# Altium project BRZ_LightLink_V2.PrjPcb
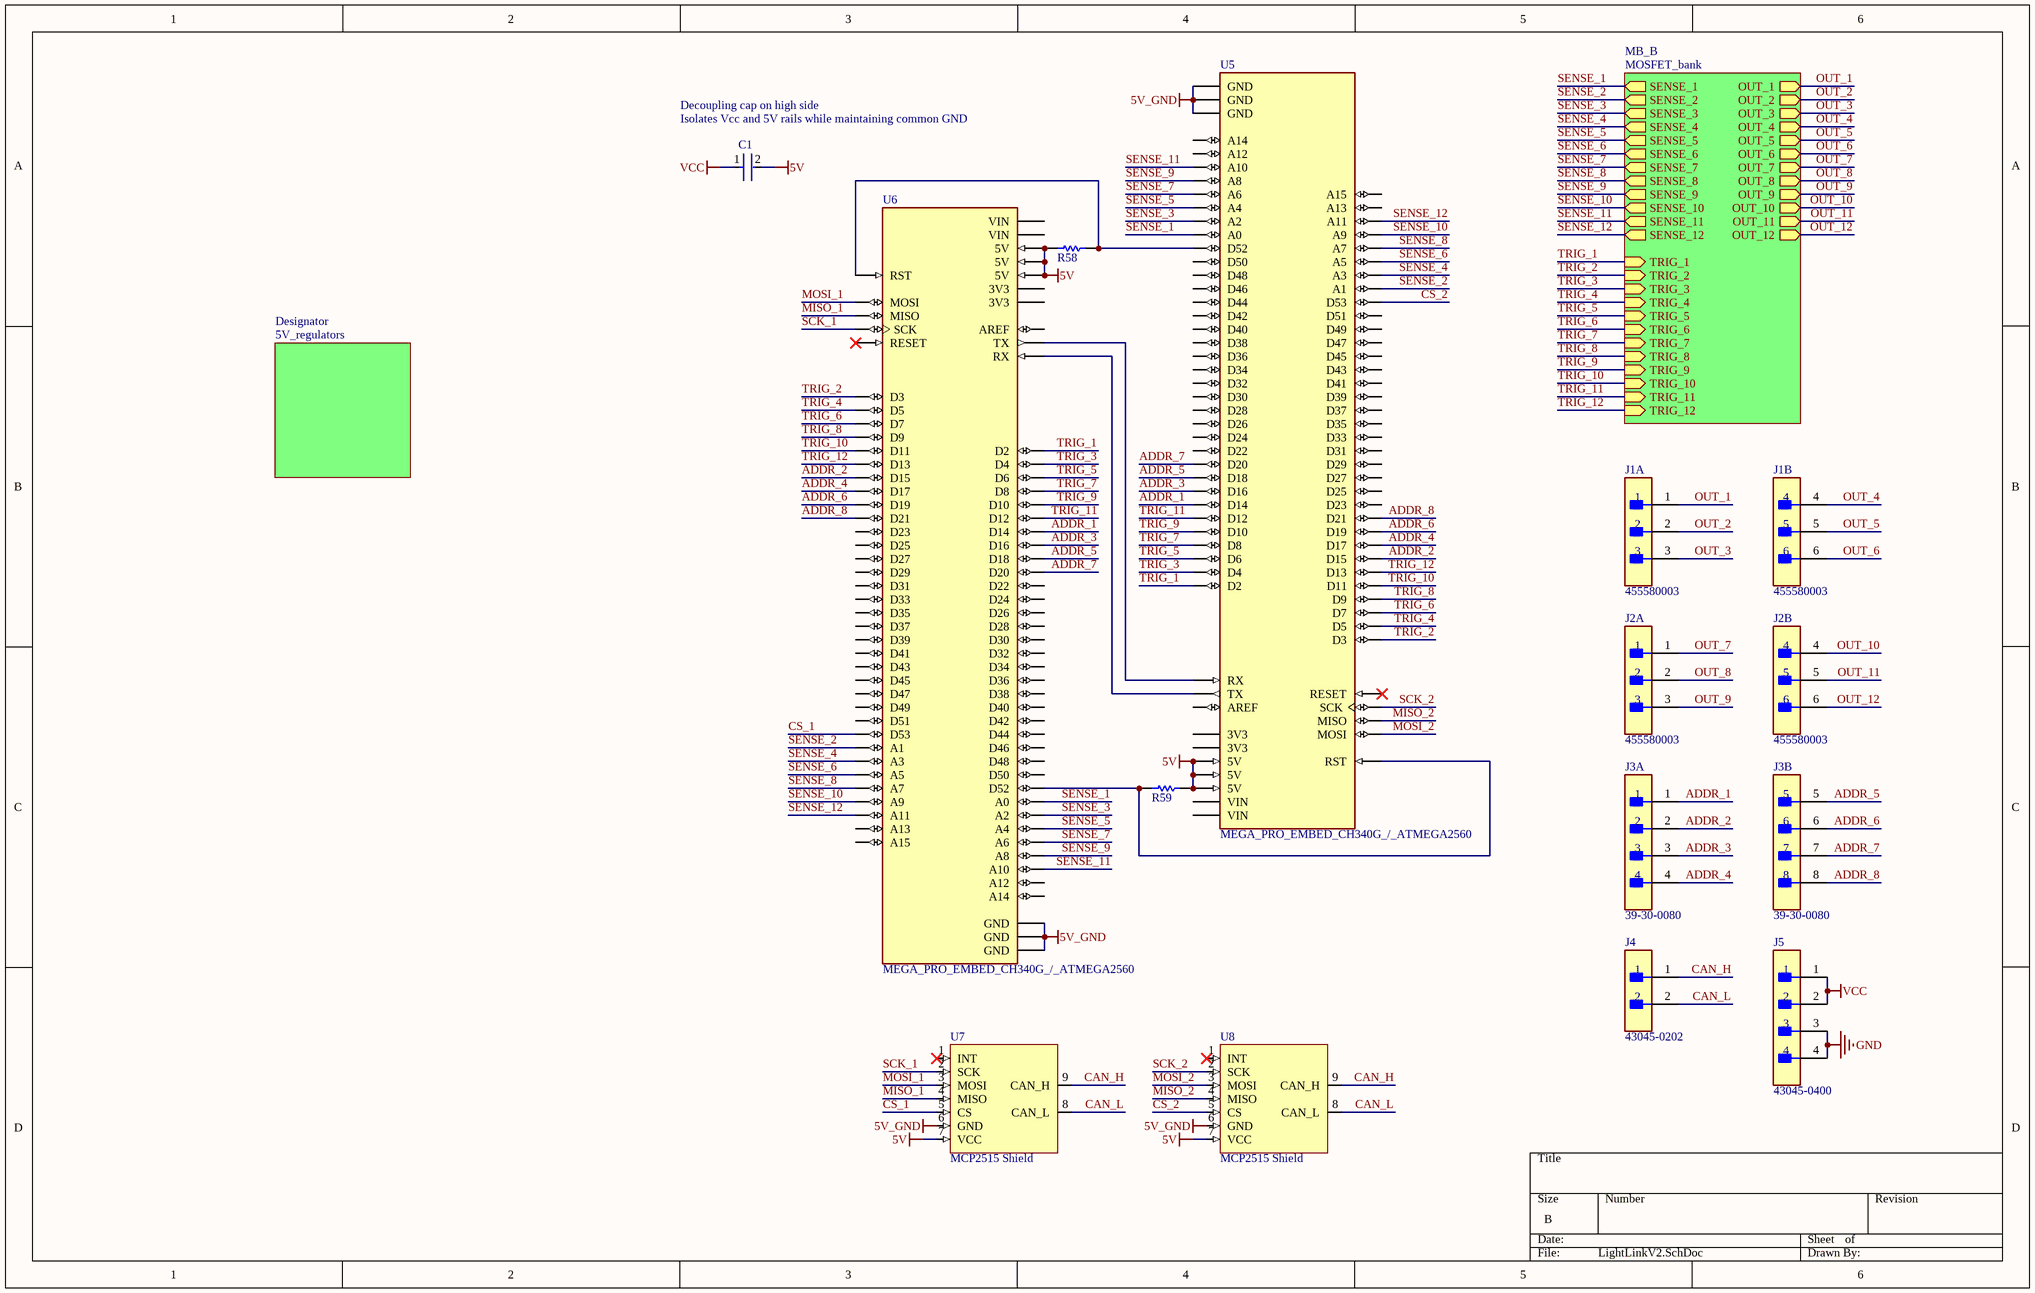
[diagram p0: LightLinkV2.SchDoc]
4 sheets, 286 parts. Net scope: hierarchical (ports join the sheet entries above them; power ports are global).
Sheets:
  LightLinkV2.SchDoc
    MB_B = MOSFET_bank.SchDoc
      M = MOSFET.SchDoc
      M = MOSFET.SchDoc
      M = MOSFET.SchDoc
      M = MOSFET.SchDoc
      M = MOSFET.SchDoc
      M = MOSFET.SchDoc
      M = MOSFET.SchDoc
      M = MOSFET.SchDoc
      M = MOSFET.SchDoc
      M = MOSFET.SchDoc
      M = MOSFET.SchDoc
      M = MOSFET.SchDoc
    Designator = 5V_regulators.SchDoc

## Sheet LightLinkV2.SchDoc
size B; SheetNumber: 1; SheetTotal: 4

### Parts
C1  C0603C103K5RACTU  [FP-C0603C-CF-MFG]  (value not drawn)
J1  455580003  [FP-455580003-MFG]  (parts A,B of 2)
J2  455580003  [FP-455580003-MFG]  (parts A,B of 2)
J3  39-30-0080  [FP-39-30-0080-MFG]  (parts A,B of 2)
J4  43045-0202  [FP-43045-0202-MFG]
J5  43045-0400  [FP-43045-0400-MFG]
R58  ERJ3EKF1002V  [RESC1609X55X30LL15T15]  (value not drawn)
R59  ERJ3EKF1002V  [RESC1609X55X30LL15T15]  (value not drawn)
U5  MEGA_PRO_EMBED_CH340G_/_ATMEGA2560  [MODULE_MEGA_PRO_EMBED_CH340G_/_ATMEGA2560]
U6  MEGA_PRO_EMBED_CH340G_/_ATMEGA2560  [MODULE_MEGA_PRO_EMBED_CH340G_/_ATMEGA2560]
U7  MCP2515 Shield  [MCP2515 Shield-Footprint-1]
U8  MCP2515 Shield  [MCP2515 Shield-Footprint-1]

### Sub-sheets
Designator = 5V_regulators: no entries
MB_B = MOSFET_bank: SENSE_1 (out), SENSE_2 (out), SENSE_3 (out), SENSE_4 (out), TRIG_1 (in), OUT_1 (out), TRIG_2 (in), OUT_2 (out), TRIG_3 (in), OUT_3 (out), TRIG_4 (in), OUT_4 (out), SENSE_5 (out), SENSE_6 (out), SENSE_7 (out), SENSE_8 (out), TRIG_5 (in), OUT_5 (out), TRIG_6 (in), OUT_6 (out), TRIG_7 (in), OUT_7 (out), TRIG_8 (in), OUT_8 (out), SENSE_9 (out), SENSE_10 (out), SENSE_11 (out), SENSE_12 (out), TRIG_9 (in), OUT_9 (out), TRIG_10 (in), OUT_10 (out), TRIG_11 (in), OUT_11 (out), TRIG_12 (in), OUT_12 (out)

### Nets
5V: C1.2 R58.2 R59.1 U5.5V_1(5V) U5.5V_2(5V) U5.5V_3(5V) U6.5V_1(5V) U6.5V_2(5V) U6.5V_3(5V) U7.7(VCC) U8.7(VCC)
5V_GND: U5.GND_1(GND) U5.GND_2(GND) U5.GND_3(GND) U6.GND_1(GND) U6.GND_2(GND) U6.GND_3(GND) U7.6(GND) U8.6(GND)
GND: J5.3 J5.4
VCC: C1.1 J5.1 J5.2
ADDR_1: J3.1 U5.D14 U6.D14
ADDR_2: J3.2 U5.D15 U6.D15
ADDR_3: J3.3 U5.D16 U6.D16
ADDR_4: J3.4 U5.D17 U6.D17
ADDR_5: J3.5 U5.D18 U6.D18
ADDR_6: J3.6 U5.D19 U6.D19
ADDR_7: J3.7 U5.D20 U6.D20
ADDR_8: J3.8 U5.D21 U6.D21
CAN_H: J4.1 U7.9(CAN_H) U8.9(CAN_H)
CAN_L: J4.2 U7.8(CAN_L) U8.8(CAN_L)
CS_1: U6.D53 U7.5(CS)
CS_2: U5.D53 U8.5(CS)
MISO_1: U6.MISO U7.4(MISO)
MISO_2: U5.MISO U8.4(MISO)
MOSI_1: U6.MOSI U7.3(MOSI)
MOSI_2: U5.MOSI U8.3(MOSI)
OUT_1: J1.1 ; sheet MB_B/OUT_1
OUT_2: J1.2 ; sheet MB_B/OUT_2
OUT_3: J1.3 ; sheet MB_B/OUT_3
OUT_4: J1.4 ; sheet MB_B/OUT_4
OUT_5: J1.5 ; sheet MB_B/OUT_5
OUT_6: J1.6 ; sheet MB_B/OUT_6
OUT_7: J2.1 ; sheet MB_B/OUT_7
OUT_8: J2.2 ; sheet MB_B/OUT_8
OUT_9: J2.3 ; sheet MB_B/OUT_9
OUT_10: J2.4 ; sheet MB_B/OUT_10
OUT_11: J2.5 ; sheet MB_B/OUT_11
OUT_12: J2.6 ; sheet MB_B/OUT_12
SCK_1: U6.SCK U7.2(SCK)
SCK_2: U5.SCK U8.2(SCK)
SENSE_1: U5.A0 U6.A0 ; sheet MB_B/SENSE_1
SENSE_2: U5.A1 U6.A1 ; sheet MB_B/SENSE_2
SENSE_3: U5.A2 U6.A2 ; sheet MB_B/SENSE_3
SENSE_4: U5.A3 U6.A3 ; sheet MB_B/SENSE_4
SENSE_5: U5.A4 U6.A4 ; sheet MB_B/SENSE_5
SENSE_6: U5.A5 U6.A5 ; sheet MB_B/SENSE_6
SENSE_7: U5.A6 U6.A6 ; sheet MB_B/SENSE_7
SENSE_8: U5.A7 U6.A7 ; sheet MB_B/SENSE_8
SENSE_9: U5.A8 U6.A8 ; sheet MB_B/SENSE_9
SENSE_10: U5.A9 U6.A9 ; sheet MB_B/SENSE_10
SENSE_11: U5.A10 U6.A10 ; sheet MB_B/SENSE_11
SENSE_12: U5.A11 U6.A11 ; sheet MB_B/SENSE_12
TRIG_1: U5.D2 U6.D2 ; sheet MB_B/TRIG_1
TRIG_2: U5.D3 U6.D3 ; sheet MB_B/TRIG_2
TRIG_3: U5.D4 U6.D4 ; sheet MB_B/TRIG_3
TRIG_4: U5.D5 U6.D5 ; sheet MB_B/TRIG_4
TRIG_5: U5.D6 U6.D6 ; sheet MB_B/TRIG_5
TRIG_6: U5.D7 U6.D7 ; sheet MB_B/TRIG_6
TRIG_7: U5.D8 U6.D8 ; sheet MB_B/TRIG_7
TRIG_8: U5.D9 U6.D9 ; sheet MB_B/TRIG_8
TRIG_9: U5.D10 U6.D10 ; sheet MB_B/TRIG_9
TRIG_10: U5.D11 U6.D11 ; sheet MB_B/TRIG_10
TRIG_11: U5.D12 U6.D12 ; sheet MB_B/TRIG_11
TRIG_12: U5.D13 U6.D13 ; sheet MB_B/TRIG_12
NetR58_1: R58.1 U5.D52 U6.RST
NetR59_2: R59.2 U5.RST U6.D52
NetU5_RX: U5.RX U6.TX
NetU5_TX: U5.TX U6.RX

Not connected (* = marked no-connect by the designer): U5 3V3_1(3V3) 3V3_2(3V3) A12 A13 A14 A15 AREF D22 D23 D24 D25 D26 D27 D28 D29 D30 D31 D32 D33 D34 D35 D36 D37 D38 D39 D40 D41 D42 D43 D44 D45 D46 D47 D48 D49 D50 D51 RESET* VIN_1(VIN) VIN_2(VIN); U6 3V3_1(3V3) 3V3_2(3V3) A12 A13 A14 A15 AREF D22 D23 D24 D25 D26 D27 D28 D29 D30 D31 D32 D33 D34 D35 D36 D37 D38 D39 D40 D41 D42 D43 D44 D45 D46 D47 D48 D49 D50 D51 RESET* VIN_1(VIN) VIN_2(VIN); U7 1(INT)*; U8 1(INT)*

### Notes on the sheet
- Decoupling cap on high side
- (near C1) Isolates Vcc and 5V rails while maintaining common GND

### Library data of the parts
C1 = CMP-2006-03046-3: CAP CER 10000PF 50V X7R 0603; Manufacturer: KEMET; Temperature Coefficient: 30ppm/°C; Capacitance: 10,000 pF; Automotive Grade: Grade 1; Material: Ceramic; Value: 10,000 pF; Tolerance: 0.1; Voltage Rating: 50 V; Digikey Description: CAP CER 10000PF 50V X7R 0603; ComponentLink2Description: Datasheet; Mouser Description: Ceramic Capacitor 0.01Uf, 50V, X7R, 10%, 0603, Full Reel; ComponentLink2URL: https://api.kemet.com/component-edge/download/datasheet/C0603C100J5GACAUTO.pdf; Package: C0603C-CF; RoHS: TRUE; Octopart: https://octopart.com/c0603c103k5ractu-kemet-133094; Device Class L1: Passive Components; Manufacturer Part Number: C0603C103K5RACTU; Temperature Range Low: -55°C; Automotive: Yes; Category: Cap; Lead Free: Yes; Temperature: -55°C to +125°C; Temperature Range High: +125°C; Temperature Characteristic: X7R; Height: 0.87mm; Device Class L3: Ceramic Capacitors; Device Class L2: Capacitors
J1 J2 = CMP-04776-000024-1: CONN HEADER R/A 6POS 4.2MM; Manufacturer: Molex; Standoff Height: 0.4mm; Conn Orientation: Right Angle; Number Of Contacts: 6; Conn Gender: Male; Voltage Rating: 600V; Current Rating: 8A; Footprint Url: https://www.molex.com/pdm_docs/sd/455580003_sd.pdf; Number Of Rows: 2; Lead Free: Yes; Digikey Description: CONN HEADER R/A 6POS 4.2MM; ComponentLink2URL: https://www.molex.com/webdocs/datasheets/pdf/en-us/0455580003_PCB_HEADERS.pdf; Octopart: https://octopart.com/45558-0003-molex-7672845; Package: 0; Device Class L3: unset; ComponentLink2Description: Datasheet; Device Class L2: Headers and Wire Housings; Category: Conn; Contact Material: Tin,Nickel; Mouser Description: Conn Power HDR 6 POS 4.2mm Solder ST Thru-Hole 6 Terminal 1 Port Mini-Fit Jr™ Tray; Manufacturer Part Number: 455580003; Pitch: 4.2mm; Device Class L1: Connectors; Temperature Range Low: -40°C; Temperature: -40°C to +105°C; RoHS: TRUE; Temperature Range High: +105°C; Height: 10.38mm; Automotive: No
J3 = CMP-04776-000387-1: CONN HEADER R/A 8POS 4.2MM; Number of Contacts: 8; Max Voltage Rating (AC): 600V; Insulation Resistance: 1GR; Contact Resistance: 10mR; Max Current Rating: 7A; Gender: Male; Row Spacing: 0.165inch; Approvals: UL; Number of Ports: 1; Current Rating: 13A; Glow Wire Compliant: Non-compliant; Pitch: 4.2mm; Housing Material: Nylon; Color: Natural; Max Operating Temperature: 105°C; Packaging: Bag; Termination: Solder; Flammability Rating: UL94 V-0; Width: 11.4mm; Contact Plating: Tin; Material: Nylon; Mount: Through Hole; Height: 11.4mm; Halogen Free: Low Halogen; Depth: 19.4mm; ELV: Compliant; Number of Terminals/Pins: 8; Orientation: Right Angle; Number of Positions: 8; Contact Material: Brass; Number of Rows: 2; Lead Free: Lead Free; Contact Type: Male Pin; Min Operating Temperature: -40°C; Fastening Type: Ramp; Package Quantity: 225; Voltage Rating (DC): 600V; Number of Circuits: 8; Housing Color: Natural; Voltage Rating: 600V; Series: Mini-Fit® Jr™ 5569; Contact Gender: Male; Length: 18mm
J4 = CMP-04776-000660-1: CONN HEADER R/A 2POS; Number of Contacts: 2; Current Rating: 5A; Gender: Male; Contact Resistance: 10mR; Voltage Rating (DC): 250V; Glow Wire Compliant: Compliant; Voltage Rating: 600V; Pitch: 3mm; Max Voltage Rating (DC): 250.25kV; Insulation Resistance: 1GR; Radiation Hardening: No; Halogen Free: Low Halogen; Number of Positions: 2; Mount: Through Hole; RoHS Compliant: Yes; Lead Free: Contains Lead; Color: Black; Max Current Rating: 5A; Length: 7.15mm; Orientation: Right Angle; Termination: Solder; Height: 8.77mm; Flammability Rating: UL94 V-0; Diameter: 3mm; Min Operating Temperature: -40°C; Series: Micro-Fit 3.0; Max Operating Temperature: 105°C; Number of Circuits: 2; Number of Rows: 2; Depth: 12.2mm; Housing Color: Black; Contact Plating: Gold; Case/Package: SMC; Contact Material: Brass; Packaging: Tray; Housing Material: Thermoplastic; Package Quantity: 3168
J5 = CMP-04776-000002-1: CONN HEADER R/A 4POS 3MM; Manufacturer: Molex; Conn Gender: Male; Conn Orientation: Right Angle; Voltage Rating: 600V; Number Of Contacts: 4; Is Female: yes; Current Rating: 8.5A; ComponentLink2URL: https://www.molex.com/webdocs/datasheets/pdf/en-us/0430450400_PCB_HEADERS.pdf; Manufacturer Part Number: 43045-0400; Digikey Description: CONN HEADER R/A 4POS 3MM; Category: Conn; Temperature Range High: +105°C; Lead Free: Yes; Device Class L1: Connectors; Automotive: No; Temperature: -40°C to +105°C; Footprint Url: https://www.molex.com/pdm_docs/sd/430450400_sd.pdf; Height: 9.27mm; Number Of Rows: 2; Device Class L3: unset; Pitch: 3mm; Temperature Range Low: -40°C; Contact Material: Tin,Nickel; Octopart: https://octopart.com/43045-0400-molex-287063; RoHS: TRUE; ComponentLink2Description: Datasheet; Package: 43045-0400; Device Class L2: Headers and Wire Housings
R58 R59 = CMP-1012-00623-3: Chip Resistor, 10 KOhm, +/- 1%, 0.1 W, -55 to 155 degC, 0603 (1608 Metric), RoHS, Tape and Reel; Manufacturer: Panasonic; Voltage Rating: 75V; Case\/Package: 0603; Power Rating: 100mW; Resistance: 10KOhm; Temperature Coefficient: 100ppm\/degreesC; Number of Pins: 2; Package Reference: 603; Depth: 0.8mm; Mount: SurfaceMount; Package Description: 2-Pin Surface Mount Device, Body 1.6 x 0.85 mm; Datasheet Version: 02/2017; Length: 1.6mm; Lead Free: LeadFree; Height: 0.45mm; Number of Terminations: 2; Max Power Dissipation: 100mW; Min Operating Temperature: -55degC; Datasheet URL: https://industrial.panasonic.com/cdbs/www-data/pdf/RDA0000/AOA0000C304.pdf; Termination: SMD/SMT; Case Code (Metric): 1608; Case Code (Imperial): 0603; Tolerance: 1%; Max Operating Temperature: 155degC; RoHSCompliant: true; Voltage Rating (DC): 75V; Radiation Hardening: No; Packaging: TapeandReel; Composition: ThickFilm; Mounting Technology: SurfaceMount; Manufacturer URL: http://www.panasonic.com/; Width: 0.031inch; REACH SVHC: NoSVHC; Contact Plating: Tin; Military Standard: Not; Package Quantity: 1
U5 U6 = CMP-002-000002-2: Mega 2560 PRO (Embed) CH340G/ATmega2560-16AU; Component Type: Standard; Design Item ID: MEGA_PRO_EMBED_CH340G_/_ATMEGA2560; Price: None; Pin Count: 86; Source: MEGA_PRO_EMBED_CH340G___ATMEGA2560.SchLib; Value: *; Availability: Unavailable; MP: MEGA_PRO_EMBED_CH340G_/_ATMEGA2560; Package: None
U7 U8 = CMP-015-00008-2: PCB layout of Arduino MCP2515 shield to avoid remaking the schematic and ordering individual components when I already have a dozen shields on hand.

## Sheet MOSFET_bank.SchDoc
size B; SheetNumber: 2; SheetTotal: 4
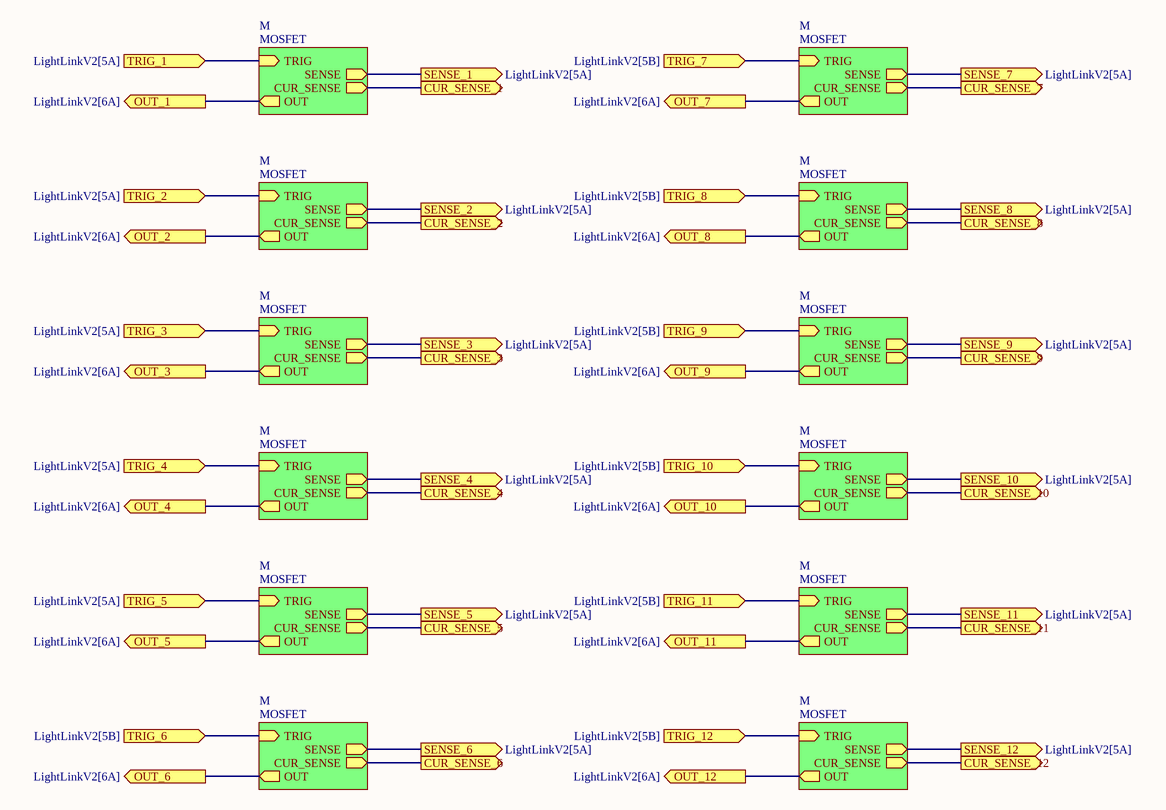
[diagram p1: MOSFET_bank.SchDoc]

### Sub-sheets
M = MOSFET: TRIG (in), OUT (out), SENSE (out), CUR_SENSE (out)
M = MOSFET: TRIG (in), OUT (out), SENSE (out), CUR_SENSE (out)
M = MOSFET: TRIG (in), OUT (out), SENSE (out), CUR_SENSE (out)
M = MOSFET: TRIG (in), OUT (out), SENSE (out), CUR_SENSE (out)
M = MOSFET: TRIG (in), OUT (out), SENSE (out), CUR_SENSE (out)
M = MOSFET: TRIG (in), OUT (out), SENSE (out), CUR_SENSE (out)
M = MOSFET: TRIG (in), OUT (out), SENSE (out), CUR_SENSE (out)
M = MOSFET: TRIG (in), OUT (out), SENSE (out), CUR_SENSE (out)
M = MOSFET: TRIG (in), OUT (out), SENSE (out), CUR_SENSE (out)
M = MOSFET: TRIG (in), OUT (out), SENSE (out), CUR_SENSE (out)
M = MOSFET: TRIG (in), OUT (out), SENSE (out), CUR_SENSE (out)
M = MOSFET: TRIG (in), OUT (out), SENSE (out), CUR_SENSE (out)

### Ports
CUR_SENSE_1 (out), CUR_SENSE_2 (out), CUR_SENSE_3 (out), CUR_SENSE_4 (out), CUR_SENSE_5 (out), CUR_SENSE_6 (out), CUR_SENSE_7 (out), CUR_SENSE_8 (out), CUR_SENSE_9 (out), CUR_SENSE_10 (out), CUR_SENSE_11 (out), CUR_SENSE_12 (out), OUT_1 (out, see LightLinkV2[6A]), OUT_2 (out, see LightLinkV2[6A]), OUT_3 (out, see LightLinkV2[6A]), OUT_4 (out, see LightLinkV2[6A]), OUT_5 (out, see LightLinkV2[6A]), OUT_6 (out, see LightLinkV2[6A]), OUT_7 (out, see LightLinkV2[6A]), OUT_8 (out, see LightLinkV2[6A]), OUT_9 (out, see LightLinkV2[6A]), OUT_10 (out, see LightLinkV2[6A]), OUT_11 (out, see LightLinkV2[6A]), OUT_12 (out, see LightLinkV2[6A]), SENSE_1 (out, see LightLinkV2[5A]), SENSE_2 (out, see LightLinkV2[5A]), SENSE_3 (out, see LightLinkV2[5A]), SENSE_4 (out, see LightLinkV2[5A]), SENSE_5 (out, see LightLinkV2[5A]), SENSE_6 (out, see LightLinkV2[5A]), SENSE_7 (out, see LightLinkV2[5A]), SENSE_8 (out, see LightLinkV2[5A]), SENSE_9 (out, see LightLinkV2[5A]), SENSE_10 (out, see LightLinkV2[5A]), SENSE_11 (out, see LightLinkV2[5A]), SENSE_12 (out, see LightLinkV2[5A]), TRIG_1 (in, see LightLinkV2[5A]), TRIG_2 (in, see LightLinkV2[5A]), TRIG_3 (in, see LightLinkV2[5A]), TRIG_4 (in, see LightLinkV2[5A]), TRIG_5 (in, see LightLinkV2[5A]), TRIG_6 (in, see LightLinkV2[5B]), TRIG_7 (in, see LightLinkV2[5B]), TRIG_8 (in, see LightLinkV2[5B]), TRIG_9 (in, see LightLinkV2[5B]), TRIG_10 (in, see LightLinkV2[5B]), TRIG_11 (in, see LightLinkV2[5B]), TRIG_12 (in, see LightLinkV2[5B])

### Nets
OUT_1: port OUT_1, sheet M/OUT
OUT_2: port OUT_2, sheet M/OUT
OUT_3: port OUT_3, sheet M/OUT
OUT_4: port OUT_4, sheet M/OUT
OUT_5: port OUT_5, sheet M/OUT
OUT_6: port OUT_6, sheet M/OUT
OUT_7: port OUT_7, sheet M/OUT
OUT_8: port OUT_8, sheet M/OUT
OUT_9: port OUT_9, sheet M/OUT
OUT_10: port OUT_10, sheet M/OUT
OUT_11: port OUT_11, sheet M/OUT
OUT_12: port OUT_12, sheet M/OUT
SENSE_1: port SENSE_1, sheet M/SENSE
SENSE_2: port SENSE_2, sheet M/SENSE
SENSE_3: port SENSE_3, sheet M/SENSE
SENSE_4: port SENSE_4, sheet M/SENSE
SENSE_5: port SENSE_5, sheet M/SENSE
SENSE_6: port SENSE_6, sheet M/SENSE
SENSE_7: port SENSE_7, sheet M/SENSE
SENSE_8: port SENSE_8, sheet M/SENSE
SENSE_9: port SENSE_9, sheet M/SENSE
SENSE_10: port SENSE_10, sheet M/SENSE
SENSE_11: port SENSE_11, sheet M/SENSE
SENSE_12: port SENSE_12, sheet M/SENSE
TRIG_1: port TRIG_1, sheet M/TRIG
TRIG_2: port TRIG_2, sheet M/TRIG
TRIG_3: port TRIG_3, sheet M/TRIG
TRIG_4: port TRIG_4, sheet M/TRIG
TRIG_5: port TRIG_5, sheet M/TRIG
TRIG_6: port TRIG_6, sheet M/TRIG
TRIG_7: port TRIG_7, sheet M/TRIG
TRIG_8: port TRIG_8, sheet M/TRIG
TRIG_9: port TRIG_9, sheet M/TRIG
TRIG_10: port TRIG_10, sheet M/TRIG
TRIG_11: port TRIG_11, sheet M/TRIG
TRIG_12: port TRIG_12, sheet M/TRIG
NetR1_MB_B_M#1_2: port CUR_SENSE_1, sheet M/CUR_SENSE
NetR1_MB_B_M#2_2: port CUR_SENSE_2, sheet M/CUR_SENSE
NetR1_MB_B_M#3_2: port CUR_SENSE_3, sheet M/CUR_SENSE
NetR1_MB_B_M#4_2: port CUR_SENSE_4, sheet M/CUR_SENSE
NetR1_MB_B_M#5_2: port CUR_SENSE_5, sheet M/CUR_SENSE
NetR1_MB_B_M#6_2: port CUR_SENSE_6, sheet M/CUR_SENSE
NetR1_MB_B_M#7_2: port CUR_SENSE_7, sheet M/CUR_SENSE
NetR1_MB_B_M#8_2: port CUR_SENSE_8, sheet M/CUR_SENSE
NetR1_MB_B_M#9_2: port CUR_SENSE_9, sheet M/CUR_SENSE
NetR1_MB_B_M#10_2: port CUR_SENSE_10, sheet M/CUR_SENSE
NetR1_MB_B_M#11_2: port CUR_SENSE_11, sheet M/CUR_SENSE
NetR1_MB_B_M#12_2: port CUR_SENSE_12, sheet M/CUR_SENSE

## Sheet MOSFET.SchDoc
size A4; SheetNumber: 3; SheetTotal: 3
Used 12 times, as channels MB_B/M, MB_B/M, MB_B/M, MB_B/M, MB_B/M, MB_B/M, MB_B/M, MB_B/M, MB_B/M, MB_B/M, MB_B/M, MB_B/M. Parts and nets are listed once, with the designators drawn on the sheet.
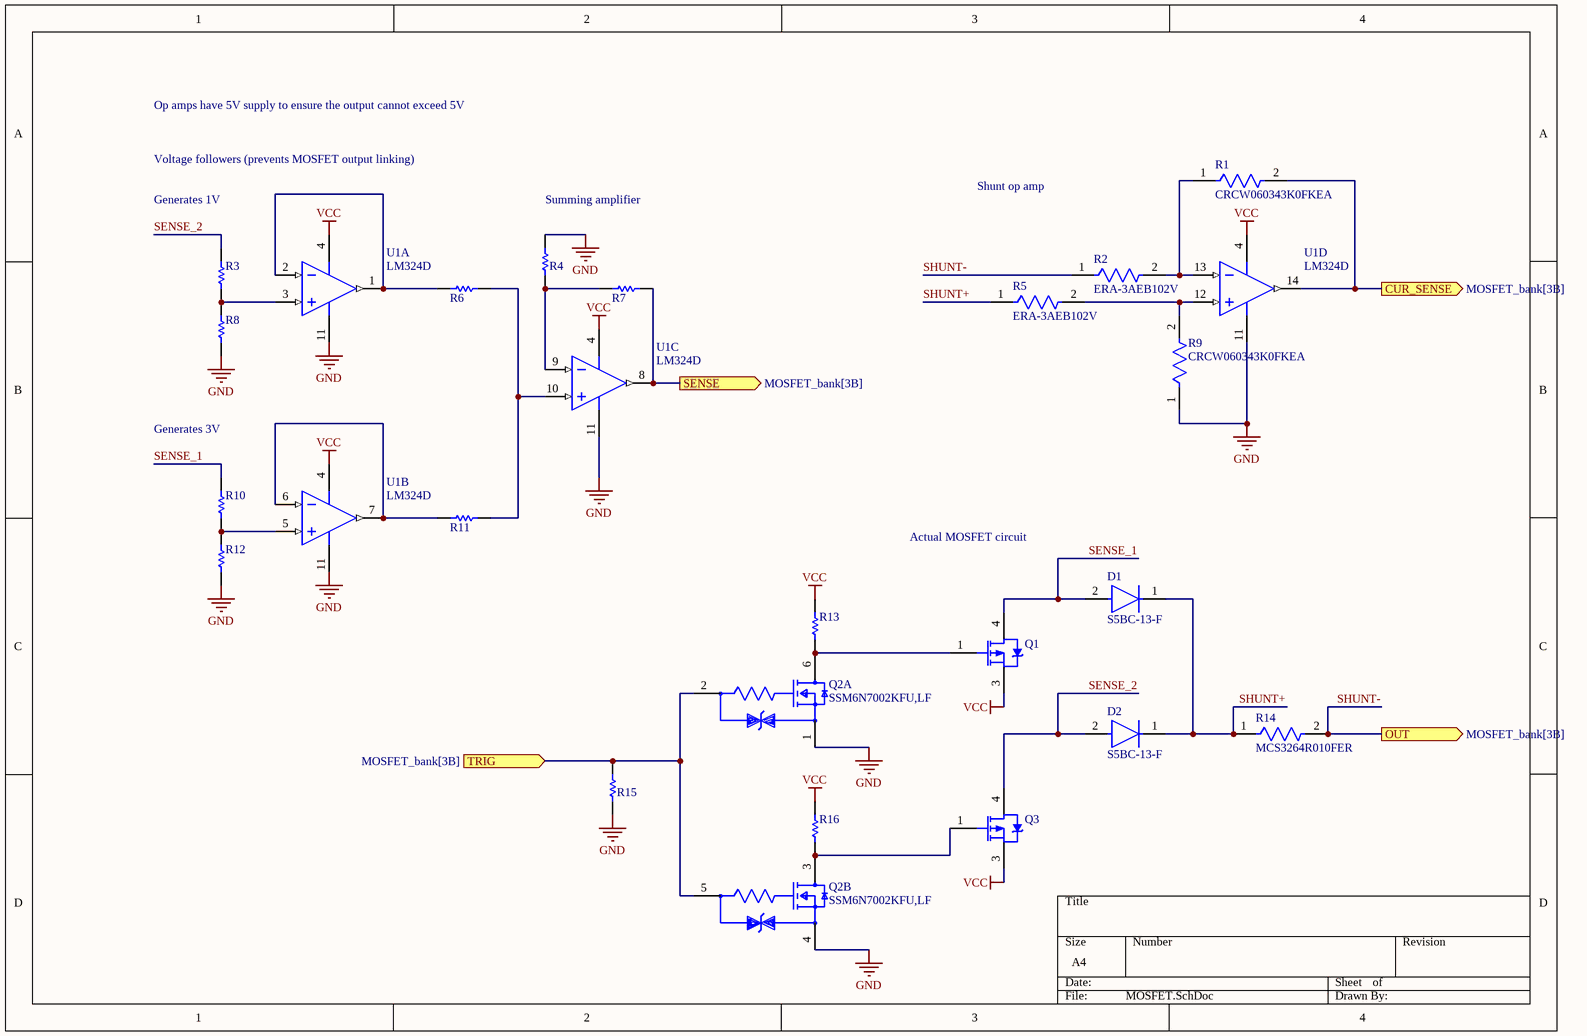
[diagram p2: MOSFET.SchDoc]

### Parts
D1  S5BC-13-F  [FP-SMC-MFG]
D2  S5BC-13-F  [FP-SMC-MFG]
Q1  NTD25P03LT4G  [ONSC-DPAK-3-369C-01_V]  (value not drawn)
Q2  SSM6N7002KFU,LF  [FP-SSOP6-P-0_65A-MFG]  (parts A,B of 2)
Q3  NTD25P03LT4G  [ONSC-DPAK-3-369C-01_V]  (value not drawn)
R1  CRCW060343K0FKEA  [FP-CRCW0603-e3-IPC_A]
R2  ERA-3AEB102V  [FP-ERA3A-IPC_C]
R3  ERJ3EKF1002V  [RESC1609X55X30LL15T15]  (value not drawn)
R4  ERJ3EKF1002V  [RESC1609X55X30LL15T15]  (value not drawn)
R5  ERA-3AEB102V  [FP-ERA3A-IPC_C]
R6  ERJ3EKF1002V  [RESC1609X55X30LL15T15]  (value not drawn)
R7  ERJ3EKF1002V  [RESC1609X55X30LL15T15]  (value not drawn)
R8  ERA-3AEB751V  [RESC1608X55X30ML20T20]  (value not drawn)
R9  CRCW060343K0FKEA  [FP-CRCW0603-e3-IPC_A]
R10  ERJ3EKF1002V  [RESC1609X55X30LL15T15]  (value not drawn)
R11  ERJ3EKF1002V  [RESC1609X55X30LL15T15]  (value not drawn)
R12  ERA3AEB242V  [RESC1608X55X30NL20T20]  (value not drawn)
R13  ERJ3EKF1002V  [RESC1609X55X30LL15T15]  (value not drawn)
R14  MCS3264R010FER  [FP-MCS3264-MFG]
R15  ERJ3EKF1002V  [RESC1609X55X30LL15T15]  (value not drawn)
R16  ERJ3EKF1002V  [RESC1609X55X30LL15T15]  (value not drawn)
U1  LM324D  [D0014A_L]  (parts A,B,C,D of 4)

### Ports
CUR_SENSE (out, see MOSFET_bank[3B]), OUT (out, see MOSFET_bank[3B]), SENSE (out, see MOSFET_bank[3B]), TRIG (in, see MOSFET_bank[3B])

### Nets
GND: Q2.1(Source1) Q2.4(Source2) R4.1 R8.1 R9.1 R12.1 R15.2 U1.11(GND)
VCC: Q1.3(S) Q3.3(S) R13.2 R16.2 U1.4(VCC)
CUR_SENSE: R1.2 U1.14(4OUT) ; port CUR_SENSE
SENSE: R7.1 U1.8(3OUT) ; port SENSE
SENSE_1: D1.2(A) Q1.4(D) R10.2
SENSE_2: D2.2(A) Q3.4(D) R3.2
SHUNT+: D1.1(C) D2.1(C) R5.1 R14.1
SHUNT-: R2.1 R14.2 ; port OUT
TRIG: Q2.2(Gate1) Q2.5(Gate2) R15.1 ; port TRIG
NetQ1_1: Q1.1(G) Q2.6(Drain1) R13.1
NetQ2_3: Q2.3(Drain2) Q3.1(G) R16.1
NetR1_1: R1.1 R2.2 U1.13(4IN-)
NetR3_1: R3.1 R8.2 U1.3(1IN+)
NetR4_2: R4.2 R7.2 U1.9(3IN-)
NetR5_2: R5.2 R9.2 U1.12(4IN+)
NetR6_1: R6.1 R11.1 U1.10(3IN+)
NetR6_2: R6.2 U1.1(1OUT) U1.2(1IN-)
NetR10_1: R10.1 R12.2 U1.5(2IN+)
NetR11_2: R11.2 U1.6(2IN-) U1.7(2OUT)

### Channels
MB_B/M: designators end in _MB_B_M#1; ports CUR_SENSE=NetR1_MB_B_M#1_2 OUT=OUT_1 SENSE=SENSE_1 TRIG=TRIG_1
MB_B/M: designators end in _MB_B_M#2; ports CUR_SENSE=NetR1_MB_B_M#2_2 OUT=OUT_2 SENSE=SENSE_2 TRIG=TRIG_2
MB_B/M: designators end in _MB_B_M#3; ports CUR_SENSE=NetR1_MB_B_M#3_2 OUT=OUT_3 SENSE=SENSE_3 TRIG=TRIG_3
MB_B/M: designators end in _MB_B_M#4; ports CUR_SENSE=NetR1_MB_B_M#4_2 OUT=OUT_4 SENSE=SENSE_4 TRIG=TRIG_4
MB_B/M: designators end in _MB_B_M#5; ports CUR_SENSE=NetR1_MB_B_M#5_2 OUT=OUT_5 SENSE=SENSE_5 TRIG=TRIG_5
MB_B/M: designators end in _MB_B_M#6; ports CUR_SENSE=NetR1_MB_B_M#6_2 OUT=OUT_6 SENSE=SENSE_6 TRIG=TRIG_6
MB_B/M: designators end in _MB_B_M#7; ports CUR_SENSE=NetR1_MB_B_M#7_2 OUT=OUT_7 SENSE=SENSE_7 TRIG=TRIG_7
MB_B/M: designators end in _MB_B_M#8; ports CUR_SENSE=NetR1_MB_B_M#8_2 OUT=OUT_8 SENSE=SENSE_8 TRIG=TRIG_8
MB_B/M: designators end in _MB_B_M#9; ports CUR_SENSE=NetR1_MB_B_M#9_2 OUT=OUT_9 SENSE=SENSE_9 TRIG=TRIG_9
MB_B/M: designators end in _MB_B_M#10; ports CUR_SENSE=NetR1_MB_B_M#10_2 OUT=OUT_10 SENSE=SENSE_10 TRIG=TRIG_10
MB_B/M: designators end in _MB_B_M#11; ports CUR_SENSE=NetR1_MB_B_M#11_2 OUT=OUT_11 SENSE=SENSE_11 TRIG=TRIG_11
MB_B/M: designators end in _MB_B_M#12; ports CUR_SENSE=NetR1_MB_B_M#12_2 OUT=OUT_12 SENSE=SENSE_12 TRIG=TRIG_12

### Notes on the sheet
- Op amps have 5V supply to ensure the output cannot exceed 5V
- Voltage followers (prevents MOSFET output linking)
- Generates 1V
- (near R4) Summing amplifier
- Shunt op amp
- Generates 3V
- Actual MOSFET circuit

### Library data of the parts
D1 D2 = CMP-2000-07025-2: DIODE GEN PURP 100V 5A SMC; Manufacturer: Diodes Inc.; Peak Reverse Current: 10uA; Max Junction Temp: +150°C; Max Surge Forward Current: 100A; Value: 40pF; Standoff Height: 0.1mm; Octopart: https://octopart.com/s5bc-13-f-diodes+inc.-333396; Category: Diode; Manufacturer Part Number: S5BC-13-F; RoHS: TRUE; Footprint Url: https://www.diodes.com/assets/Package-Files/SMC.pdf; Device Class L1: Discrete Semiconductors; Temperature Range Low: -65°C; Lead Free: Yes; ComponentLink2URL: https://www.diodes.com/assets/Datasheets/ds16007.pdf; Package: SMC; Max Repetitive Reverse Voltage: 100V; Device Class L3: Rectifier Diodes; Automotive: No; Forward Current: 5A; Temperature: -65°C to +150°C; Digikey Description: DIODE GEN PURP 100V 5A SMC; Reverse Voltage: 100V; Capacitance: 40pF; Mouser Description: Rectifiers 100V 5A; ComponentLink2Description: Datasheet; Device Class L2: Diodes; Temperature Range High: +150°C; Height: 2.5mm
Q1 Q3 = CMP-1058-00409-1: Power MOSFET, -25 A, -30 V, Logic Level P-Channel, 3-Pin DPAK, Pb-Free, Tape and Reel; Manufacturer: On Semiconductor; Coss Typ (pF): 290; Crss Typ (pF): 105; V(BR)DSS Min (V): 30; VGS Max (V): 15; PD Max (W): 75; Ciss Typ (pF): 900; ID Max (A): 25; Qrr Typ (nC): 35; Configuration: Single; Channel Polarity: P Channel; VGS(th) Max (V): 2; Mounting Technology: Surface Mount; ComponentLink2Description: Datasheet; ComponentLink3URL: http://www.onsemi.cn/pub_link/Collateral/369C.PDF; ComponentLink1Description: Manufacturer URL; ComponentLink3Description: Package Specification; Packing: Tape and Reel; DatasheetVersion: Rev. 4; PackageDescription: 3-Pin Flange Mount, Body 6.54 x 6.095 mm, Pitch 2.29 mm; ComponentLink2URL: http://www.onsemi.cn/pub_link/Collateral/NTD25P03L-D.PDF; PackageReference: DPAK-3-369C-01; Package Type: DPAK-3; PackageVersion: Rev. E, 02/2014; ComponentLink1URL: http://www.onsemi.com/; RoHS: Pb-Free; PartNumber: NTD25P03LT4G
Q2 = CMP-35916-000009-1: MOSFET 2N-CH 60V 0.3A; Input Capacitance: 40pF; Continuous Drain Current (ID): 300mA; Max Power Dissipation: 285mW; FET Type: 2 N-Channel; Rds On Max: 1.5R; Mount: Surface Mount; Drain to Source Voltage (Vdss): 60V; Packaging: Tape and Reel
R1 R9 = CMP-2000-03352-2: RES Thick Film, 43kΩ, 1%, 0.1W, 100ppm/°C, 0603; Voltage Rating: 75V; Power Rating: 100mW; Resistance: 43kR; Height: 0.45mm; Contact Plating: Tin; Depth: 0.85mm; Case Code (Metric): 1608; Min Operating Temperature: -55°C; Length: 1.55mm; Voltage Rating (DC): 75V; Tolerance: 1%; Case Code (Imperial): 0603; Features: Automotive AEC-Q200; Number of Pins: 2; Lead Free: Lead Free; Number of Terminations: 2; Temperature Coefficient: 100ppm/°C; Max Power Dissipation: 100mW; Package Quantity: 10; Weight: 7.1E-05oz; Military Standard: Not; Termination: SMD/SMT; Max Operating Temperature: 155°C; Radiation Hardening: No; Width: 0.033inch; Mount: Surface Mount; Composition: Thick Film; Case/Package: 0603; Packaging: Tape and Reel
R2 R5 = CMP-2000-00873-2: RES SMD 1K OHM 0.1% 1/10W 0603; Temperature Coefficient: 25ppm/°C; Voltage Rating: 75V; Max Power Dissipation: 100mW; Resistance: 1kR; Technology: METAL FILM; Number of Pins: 2; Packaging: Tape and Reel; Case Code (Imperial): 0603; Case Code (Metric): 1608; Min Operating Temperature: -55°C; REACH SVHC: No SVHC; Length: 1.6mm; Termination: SMD/SMT; Depth: 0.8mm; Resistance Tolerance: 0.1%; Number of Terminations: 2; Width: 0.8mm; Military Standard: Not; Tolerance: 0.1%; Package Quantity: 5000; Contact Plating: Tin; Height: 0.45mm; Construction: Rectangular; Case/Package: 0603; Max Operating Temperature: 155°C; Resistor Type: Thin Film; Series: ERA-3A; Size Code: 0603; RoHS Compliant: Yes; Mount: Surface Mount; Radiation Hardening: No; Power Rating: 100mW
R3 R4 R6 R7 R10 R11 R13 R15 R16 = CMP-1012-00623-3: as R58 on sheet LightLinkV2; Number of Pins: 2; Package Reference: 603; Depth: 0.8mm; Mount: SurfaceMount; Package Description: 2-Pin Surface Mount Device, Body 1.6 x 0.85 mm; Datasheet Version: 02/2017; Length: 1.6mm; Lead Free: LeadFree; Height: 0.45mm; Number of Terminations: 2; Max Power Dissipation: 100mW; Min Operating Temperature: -55degC; Datasheet URL: https://industrial.panasonic.com/cdbs/www-data/pdf/RDA0000/AOA0000C304.pdf; Termination: SMD/SMT; Case Code (Metric): 1608; Case Code (Imperial): 0603; Tolerance: 1%; Max Operating Temperature: 155degC; RoHSCompliant: true; Voltage Rating (DC): 75V; Radiation Hardening: No; Packaging: TapeandReel; Composition: ThickFilm; Mounting Technology: SurfaceMount; Manufacturer URL: http://www.panasonic.com/; Width: 0.031inch; REACH SVHC: NoSVHC; Contact Plating: Tin; Military Standard: Not; Package Quantity: 1
R8 = CMP-2000-00122-1: Manufacturer: Panasonic; Part Number: ERA-3AEB751V
R12 = CMP-2000-00965-1: Manufacturer: Panasonic; Part Number: ERA3AEB242V
R14 = CMP-33361-000012-1: RES SMD 10 MOHM 1% 2W 3264; Temperature Coefficient: 50ppm/°C; Resistance: 10mR; Voltage Rating: 220mV; Case/Package: 2512; Military Standard: Not; Max Operating Temperature: 150°C; Height: 0.024inch; Package Quantity: 1; Case Code (Imperial): 2512; Number of Terminations: 2; Features: Flame Retardant Coating; Width: 0.126inch; Tolerance: 1%; Composition: Metal Element; Number of Pins: 2; Packaging: Tape and Reel; Depth: 3.2mm; Termination: SMD/SMT; Min Operating Temperature: -55°C; Power Rating: 2W; Case Code (Metric): 6432; Max Power Dissipation: 2W; Mount: Surface Mount; Length: 6.4mm
U1 = CMP-2000-06547-1: Quadruple Operational Amplifier, 0.5 V/us, 1.2 MHz, 3 to 32 V, 0 to 70 degC, 14-Pin SOIC (D), Green (RoHS & no Sb/Br), Tube; Manufacturer: Texas Instruments; Unity Gain Bandwidth Product: 1.2MHz; Input Offset Voltage: 7mV; Dual Supply Voltage (Max): ±16V; Single Supply Voltage (Min): 3V; Single Supply Voltage (Max): 32V; Voltage Gain in dB: 100dB; Power Supply Requirement: Single/Dual; Input Bias Current: 250nA; Dual Supply Voltage (Min): ±1.5V; Single Supply Voltage (Typ): 5/9/12/15/18/24/28V; Dual Supply Voltage (Typ): ±3/±5/±9/±12/±15V; Number of  Elements: 4; Common Mode Rejection Ratio: 65dB; Datasheet Version: Rev. W, 03/2015; Technology: Bipolar; Shut Down Feature: No; Package Reference: D0014A; Type: GeneralPurposeAmplifier; Pin Count: 14; Package Type: SOIC; Rail/Rail I/O Type: No; Manufacturer URL: http://www.ti.com/; Package Description: 14-Pin Small Outline Integrated Circuit, Body 8.65 x 3.9 mm, Pitch 1.27 mm; Operating Temperature Classification: Commercial; Datasheet URL: http://www.ti.com/lit/ds/symlink/lm324.pdf; Slew Rate: 0.5V/us; Package URL: http://www.ti.com/lit/ml/mpds177g/mpds177g.pdf; Mounting: SurfaceMount; Packaging: Rail/Tube; Mounting Technology: SurfaceMount; Operating Temp Range: 0Cto70C

## Sheet 5V_regulators.SchDoc
size B; SheetNumber: 4; SheetTotal: 4
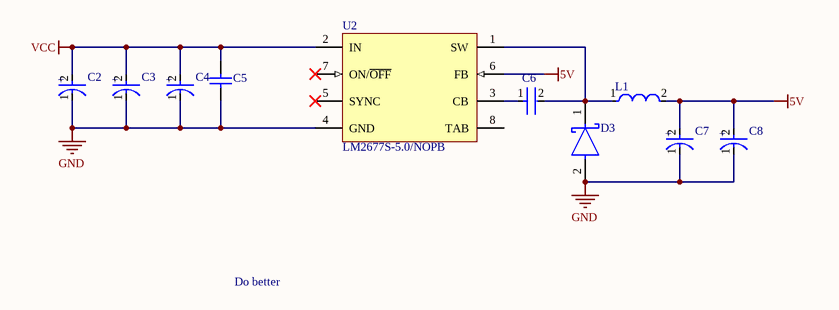
[diagram p3: 5V_regulators.SchDoc]

### Parts
C2  16TQC15M  [FP-POSCAP-B2-MFG]  (value not drawn)
C3  16TQC15M  [FP-POSCAP-B2-MFG]  (value not drawn)
C4  16TQC15M  [FP-POSCAP-B2-MFG]  (value not drawn)
C5  CAP 470nF 50V 1812(4532)  [CAPC1812(4532)125_M]  (value not drawn)
C6  C0805C103J5RACTU  [FP-C0805C-DN-MFG]  (value not drawn)
C7  25SVPF180M  [FP-OS-CON-SMT-E12-MFG]  (value not drawn)
C8  25SVPF180M  [FP-OS-CON-SMT-E12-MFG]  (value not drawn)
D3  B540C-13-F  [FP-SMC-MFG]  (value not drawn)
L1  SRP6060FA-220M  [FP-SRP6060FA-MFG]  (value not drawn)
U2  LM2677S-5.0/NOPB  [KTW0007B_N]

### Nets
5V: C7.2(A) C8.2(A) L1.2 U2.6(FB)
GND: C2.1(C) C3.1(C) C4.1(C) C5.1 C7.1(C) C8.1(C) D3.2(A) U2.4(GND)
VCC: C2.2(A) C3.2(A) C4.2(A) C5.2 U2.2(IN)
NetC6_1: C6.1 U2.3(CB)
NetC6_2: C6.2 D3.1(C) L1.1 U2.1(SW)

Not connected (* = marked no-connect by the designer): U2 5(SYNC)* 7(ON/~{OFF})* 8(TAB)

### Notes on the sheet
- Do better
- (in symbol CMP-05428-001075-1) +
- (in symbol CMP-05428-001076-1) +

### Library data of the parts
C2-C4 = CMP-05428-001076-1: Molded Tantalum Polymer Capacitor 15uF 20% 16V life 2000Hours SMD 1411; Dissipation Factor: 10%; Ripple Current: 1A; Leakage Current: 72uA; ESR (Equivalent Series Resistance): 90mR; Polarity: Polar; Height: 1.9mm; Height - Seated (Max): 0.079inch; Min Operating Temperature: -55°C; Case Code (Imperial): 1210; Package Quantity: 2000; Mount: Surface Mount; RoHS Compliant: Yes; Voltage Rating: 16V; Packaging: Tape and Reel; Number of Pins: 2; Features: General Purpose; Depth: 2.8mm; Case/Package: 1411; Case Code (Metric): 3528; Length: 3.5mm; Termination: SMD/SMT; Lead Free: Lead Free; Life (Hours): 2000Hour; Series: POSCAP™ TQC; Radiation Hardening: No; Voltage Rating (DC): 16V; Voltage: 16V; Capacitance: 15uF; REACH SVHC: No SVHC; Construction: Flat; Tolerance: 20%; Width: 2.8mm; Max Operating Temperature: 105°C
C5 = CMP-1040-01539-1: CAP 470nF 50V ±10% 1812 (4532 Metric) Thickness 1.25mm SMD; Tolerance: Â±10%; Case-Metric: 4532; Case-EIA: 1812; Technology: SMT; Max Thickness: 1.25 mm; Value: 470nF; Rated Voltage: 50 V
C6 = CMP-2007-00254-2: CAP CER 10000PF 50V X7R 0805; Manufacturer: KEMET; Value: 10,000 pF; Material: Ceramic; Temperature Coefficient: 30ppm/°C; Tolerance: 0.05; Device Class L1: Passive Components; Temperature: -55°C to +125°C; Lead Free: Yes; ComponentLink2URL: https://content.kemet.com/datasheets/KEM_C1003_C0G_SMD.pdf; Device Class L3: Ceramic Capacitors; Temperature Characteristic: X7R; Temperature Range High: +125°C; Mouser Description: Capacitor; Ceramic; Cap 0.01uF; Tol 5%; Vol-Rtg 50 V; SMT; Case 0805; X7R; TR; ComponentLink2Description: Datasheet; Manufacturer Part Number: C0805C103J5RACTU; Height: 0.88mm; Digikey Description: CAP CER 10000PF 50V X7R 0805; Capacitance: 10,000 pF; Temperature Range Low: -55°C; Device Class L2: Capacitors; Octopart: https://octopart.com/c0805c103j5ractu-kemet-133473; Voltage Rating: 50 V; Category: Cap; RoHS: TRUE; Automotive: No; Package: C0805C-DN; Ipc Land Pattern Name: CAPC200125X78
C7 C8 = CMP-05428-001075-1: Conductive Polymer Aluminum Solid Capacitors (OS-CON) 180uF ±20% 25V; Polarity: Polar; Ripple Current (AC): 4.65A; Dissipation Factor: 12%; ESR (Equivalent Series Resistance): 16mR; Life (Hours): 5000Hour; Leakage Current: 900uA; Voltage Rating (DC): 25V; Height: 11.9mm; REACH SVHC: No SVHC; Number of Pins: 12; Series: OS-CON™, SVPF; Length: 11.9mm; Packaging: Tape and Reel; Case/Package: Radial; Diameter: 8mm; Voltage: 25V; Lead Free: Lead Free; Height - Seated (Max): 0.472inch; Ripple Current: 4.65A; Package Quantity: 400; Tolerance: 20%; Max Operating Temperature: 105°C; RoHS Compliant: Yes; Mount: Surface Mount; Termination: SMD/SMT; Voltage Rating: 25V; Capacitance: 180uF; Min Operating Temperature: -55°C
D3 = CMP-2000-05097-3: DIODE SCHOTTKY 40V 5A SMC; Manufacturer: Diodes Inc.; Automotive Grade: NA; Peak Reverse Current: 0.5mA; Value: 300pF; Max Junction Temp: +150°C; Max Surge Forward Current: 100A; Standoff Height: 0.1mm; Digikey Description: DIODE SCHOTTKY 40V 5A SMC; Temperature Range Low: -55°C; Manufacturer Part Number: B540C-13-F; Octopart: https://octopart.com/b540c-13-f-diodes+inc.-325873; Lead Free: Yes; Reverse Voltage: 40V; RoHS: TRUE; Category: Diode; Mouser Description: Diode: Schottky rectifying; SMD; 40V; 5A; SMC; Package: reel, tape; ComponentLink2Description: Datasheet; Temperature Range High: +150°C; Automotive: No; Footprint Url: https://www.diodes.com/assets/Package-Files/SMC.pdf; Device Class L3: Schottky Diodes; Height: 2.5mm; Forward Current: 5A; Temperature: -55°C to +150°C; Package: SMC; ComponentLink2URL: https://www.diodes.com/assets/Datasheets/ds13012.pdf; Device Class L2: Diodes; Max Repetitive Reverse Voltage: 40V; Device Class L1: Discrete Semiconductors; Capacitance: 300pF
L1 = CMP-07248-000025-2: IND,6.6X6.4X5.8MM,22UH,20%,5A,SH; Self Resonant Frequency: 10MHz; Shielding: Shielded; Test Frequency: 100kHz; DC Resistance (DCR): 60.5mR; Core Material: Ferrite; Saturation Current: 5.6A; Current Rating: 5A; Composition: Wirewound; Inductance: 22uH; Min Operating Temperature: -55°C; Tolerance: 20%; Packaging: Tape and Reel; Ratings: AEC-Q200; Case/Package: Nonstandard; Mount: Surface Mount; Max Operating Temperature: 155°C
U2 = CMP-0069-00212-3: SIMPLE SWITCHER® High Efficiency 5A Step-Down Voltage Regulator with Sync, 7-pin TO-263, Pb-Free; Manufacturer: Texas Instruments; PackageTopMarking: NSUZXYTTE#*LM2677S*-5.0; PowerWise: N; Code_JEDEC: MO-169-AC; ComponentLink1URL: http://www.ti.com/general/docs/lit/getliterature.tsp?genericPartNumber=LM2677&fileType=pdf; PackageReference: KTW0007B; PinCount: 7; RoHS: Y; PackageDescription: TO-263, Molded, .400 x .390 x .180in Body, 7 Lead, .050in Pitch, Surface Mount; ComponentLink1Description: Datasheet URL; CompType: Switcher

## Nets that join several sheets
5V: LightLinkV2 (11 pins), 5V_regulators (C7.2 C8.2 L1.2 U2.6)
GND: LightLinkV2 (J5.3 J5.4), MB_B/M (8 pins), MB_B/M (8 pins), MB_B/M (8 pins), MB_B/M (8 pins), MB_B/M (8 pins), MB_B/M (8 pins), MB_B/M (8 pins), MB_B/M (8 pins), MB_B/M (8 pins), MB_B/M (8 pins), MB_B/M (8 pins), MB_B/M (8 pins), 5V_regulators (8 pins)
VCC: LightLinkV2 (C1.1 J5.1 J5.2), MB_B/M (5 pins), MB_B/M (5 pins), MB_B/M (5 pins), MB_B/M (5 pins), MB_B/M (5 pins), MB_B/M (5 pins), MB_B/M (5 pins), MB_B/M (5 pins), MB_B/M (5 pins), MB_B/M (5 pins), MB_B/M (5 pins), MB_B/M (5 pins), 5V_regulators (5 pins)
OUT_1: LightLinkV2 (J1.1), MB_B/M (R2_MB_B_M#1.1 R14_MB_B_M#1.2)
OUT_2: LightLinkV2 (J1.2), MB_B/M (R2_MB_B_M#2.1 R14_MB_B_M#2.2)
OUT_3: LightLinkV2 (J1.3), MB_B/M (R2_MB_B_M#3.1 R14_MB_B_M#3.2)
OUT_4: LightLinkV2 (J1.4), MB_B/M (R2_MB_B_M#4.1 R14_MB_B_M#4.2)
OUT_5: LightLinkV2 (J1.5), MB_B/M (R2_MB_B_M#5.1 R14_MB_B_M#5.2)
OUT_6: LightLinkV2 (J1.6), MB_B/M (R2_MB_B_M#6.1 R14_MB_B_M#6.2)
OUT_7: LightLinkV2 (J2.1), MB_B/M (R2_MB_B_M#7.1 R14_MB_B_M#7.2)
OUT_8: LightLinkV2 (J2.2), MB_B/M (R2_MB_B_M#8.1 R14_MB_B_M#8.2)
OUT_9: LightLinkV2 (J2.3), MB_B/M (R2_MB_B_M#9.1 R14_MB_B_M#9.2)
OUT_10: LightLinkV2 (J2.4), MB_B/M (R2_MB_B_M#10.1 R14_MB_B_M#10.2)
OUT_11: LightLinkV2 (J2.5), MB_B/M (R2_MB_B_M#11.1 R14_MB_B_M#11.2)
OUT_12: LightLinkV2 (J2.6), MB_B/M (R2_MB_B_M#12.1 R14_MB_B_M#12.2)
SENSE_1: LightLinkV2 (U5.A0 U6.A0), MB_B/M (R7_MB_B_M#1.1 U1_MB_B_M#1.8)
SENSE_2: LightLinkV2 (U5.A1 U6.A1), MB_B/M (R7_MB_B_M#2.1 U1_MB_B_M#2.8)
SENSE_3: LightLinkV2 (U5.A2 U6.A2), MB_B/M (R7_MB_B_M#3.1 U1_MB_B_M#3.8)
SENSE_4: LightLinkV2 (U5.A3 U6.A3), MB_B/M (R7_MB_B_M#4.1 U1_MB_B_M#4.8)
SENSE_5: LightLinkV2 (U5.A4 U6.A4), MB_B/M (R7_MB_B_M#5.1 U1_MB_B_M#5.8)
SENSE_6: LightLinkV2 (U5.A5 U6.A5), MB_B/M (R7_MB_B_M#6.1 U1_MB_B_M#6.8)
SENSE_7: LightLinkV2 (U5.A6 U6.A6), MB_B/M (R7_MB_B_M#7.1 U1_MB_B_M#7.8)
SENSE_8: LightLinkV2 (U5.A7 U6.A7), MB_B/M (R7_MB_B_M#8.1 U1_MB_B_M#8.8)
SENSE_9: LightLinkV2 (U5.A8 U6.A8), MB_B/M (R7_MB_B_M#9.1 U1_MB_B_M#9.8)
SENSE_10: LightLinkV2 (U5.A9 U6.A9), MB_B/M (R7_MB_B_M#10.1 U1_MB_B_M#10.8)
SENSE_11: LightLinkV2 (U5.A10 U6.A10), MB_B/M (R7_MB_B_M#11.1 U1_MB_B_M#11.8)
SENSE_12: LightLinkV2 (U5.A11 U6.A11), MB_B/M (R7_MB_B_M#12.1 U1_MB_B_M#12.8)
TRIG_1: LightLinkV2 (U5.D2 U6.D2), MB_B/M (Q2_MB_B_M#1.2 Q2_MB_B_M#1.5 R15_MB_B_M#1.1)
TRIG_2: LightLinkV2 (U5.D3 U6.D3), MB_B/M (Q2_MB_B_M#2.2 Q2_MB_B_M#2.5 R15_MB_B_M#2.1)
TRIG_3: LightLinkV2 (U5.D4 U6.D4), MB_B/M (Q2_MB_B_M#3.2 Q2_MB_B_M#3.5 R15_MB_B_M#3.1)
TRIG_4: LightLinkV2 (U5.D5 U6.D5), MB_B/M (Q2_MB_B_M#4.2 Q2_MB_B_M#4.5 R15_MB_B_M#4.1)
TRIG_5: LightLinkV2 (U5.D6 U6.D6), MB_B/M (Q2_MB_B_M#5.2 Q2_MB_B_M#5.5 R15_MB_B_M#5.1)
TRIG_6: LightLinkV2 (U5.D7 U6.D7), MB_B/M (Q2_MB_B_M#6.2 Q2_MB_B_M#6.5 R15_MB_B_M#6.1)
TRIG_7: LightLinkV2 (U5.D8 U6.D8), MB_B/M (Q2_MB_B_M#7.2 Q2_MB_B_M#7.5 R15_MB_B_M#7.1)
TRIG_8: LightLinkV2 (U5.D9 U6.D9), MB_B/M (Q2_MB_B_M#8.2 Q2_MB_B_M#8.5 R15_MB_B_M#8.1)
TRIG_9: LightLinkV2 (U5.D10 U6.D10), MB_B/M (Q2_MB_B_M#9.2 Q2_MB_B_M#9.5 R15_MB_B_M#9.1)
TRIG_10: LightLinkV2 (U5.D11 U6.D11), MB_B/M (Q2_MB_B_M#10.2 Q2_MB_B_M#10.5 R15_MB_B_M#10.1)
TRIG_11: LightLinkV2 (U5.D12 U6.D12), MB_B/M (Q2_MB_B_M#11.2 Q2_MB_B_M#11.5 R15_MB_B_M#11.1)
TRIG_12: LightLinkV2 (U5.D13 U6.D13), MB_B/M (Q2_MB_B_M#12.2 Q2_MB_B_M#12.5 R15_MB_B_M#12.1)